# Altium schematic sheet CON_PCI_Express_X8_98PIN.SchDoc: PCI Express x8 98Pin
size A4
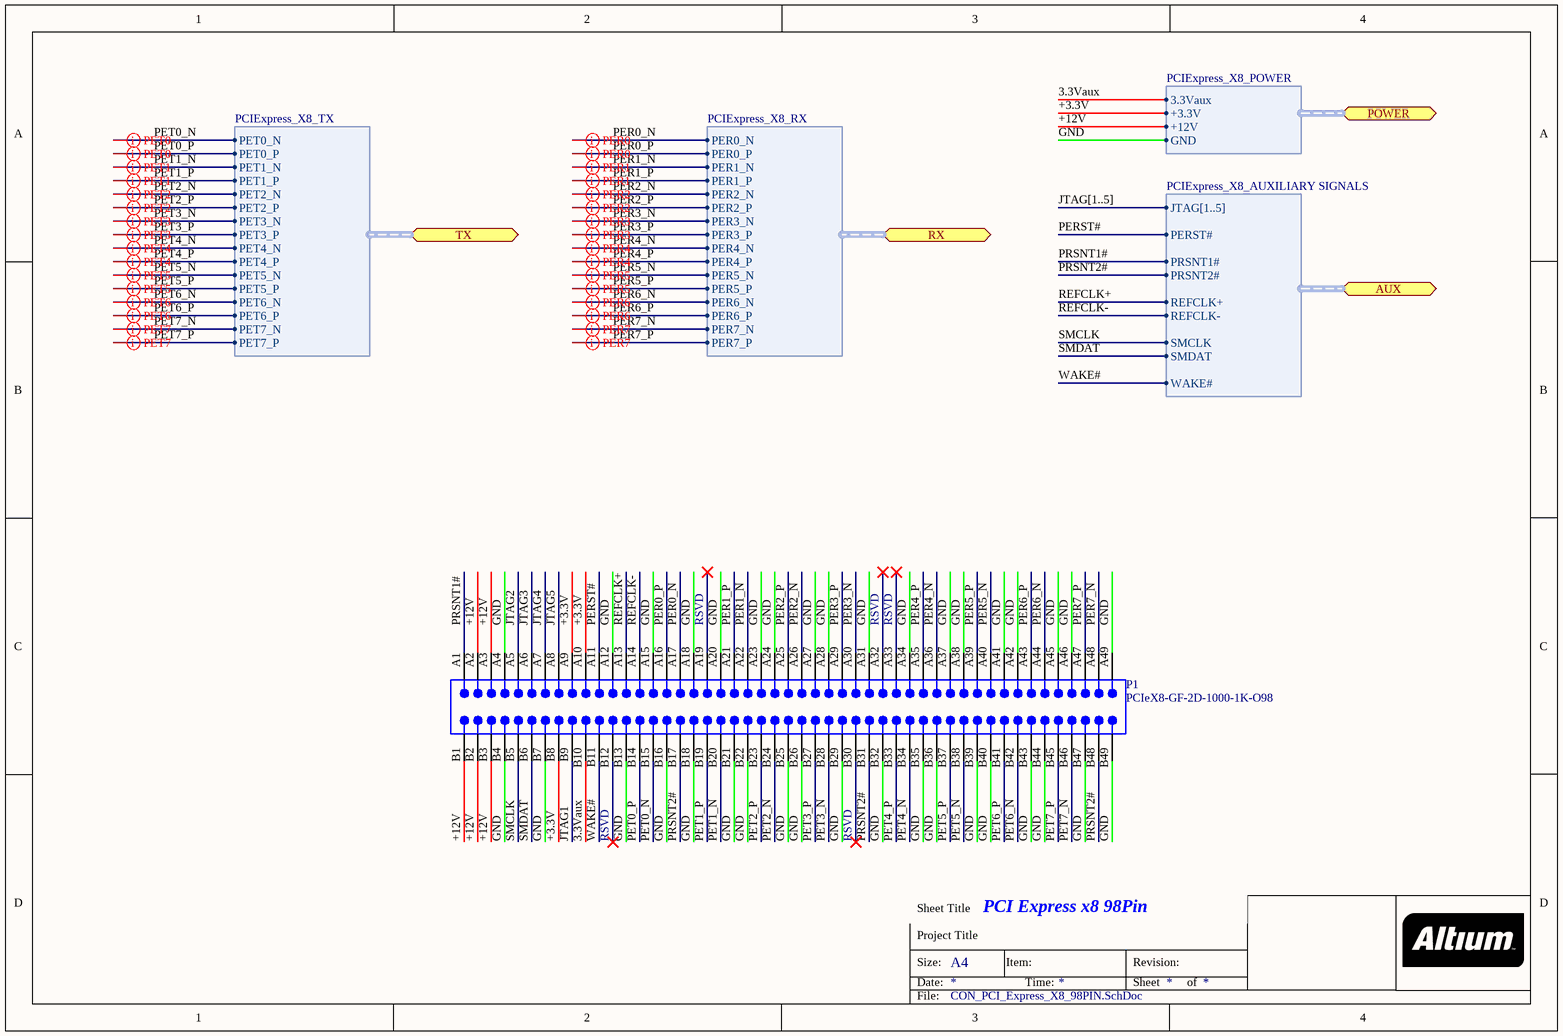
[diagram p0: CON_PCI_Express_X8_98PIN.SchDoc]

## Parts
P1  PCIeX8-GF-2D-1000-1K-O98  [PCIeX8-GF-2D-1000-1K-O98]  (no BOM)

## Ports
AUX (harness PCIExpress_X8_AUXILIARY SIGNALS), POWER (harness PCIExpress_X8_POWER), RX (harness PCIExpress_X8_RX), TX (harness PCIExpress_X8_TX)

## Harnesses
PCIExpress_X8_RX: PER0_N, PER0_P, PER1_N, PER1_P, PER2_N, PER2_P, PER3_N, PER3_P, PER4_N, PER4_P, PER5_N, PER5_P, PER6_N, PER6_P, PER7_N, PER7_P
PCIExpress_X8_TX: PET0_N, PET0_P, PET1_N, PET1_P, PET2_N, PET2_P, PET3_N, PET3_P, PET4_N, PET4_P, PET5_N, PET5_P, PET6_N, PET6_P, PET7_N, PET7_P
PCIExpress_X8_POWER: +3.3V, +12V, GND, 3.3Vaux
PCIExpress_X8_AUXILIARY SIGNALS: JTAG[1..5], PERST#, PRSNT1#, PRSNT2#, REFCLK+, REFCLK-, SMCLK, SMDAT, WAKE#

## Nets
3.3Vaux: P1.B10 ; port POWER.3.3Vaux
+3.3V: P1.A9 P1.A10 P1.B8 ; port POWER.+3.3V
+12V: P1.A2 P1.A3 P1.B1 P1.B2 P1.B3 ; port POWER.+12V
GND: P1.A4 P1.A12 P1.A15 P1.A18 P1.A20 P1.A23 P1.A24 P1.A27 P1.A28 P1.A31 P1.A34 P1.A37 P1.A38 P1.A41 P1.A42 P1.A45 P1.A46 P1.A49 P1.B4 P1.B7 P1.B13 P1.B16 P1.B18 P1.B21 P1.B22 P1.B25 P1.B26 P1.B29 P1.B32 P1.B35 P1.B36 P1.B39 P1.B40 P1.B43 P1.B44 P1.B47 P1.B49 ; port POWER.GND
JTAG1: P1.B9
JTAG2: P1.A5
JTAG3: P1.A6
JTAG4: P1.A7
JTAG5: P1.A8
PER0_N: P1.A17 ; port RX.PER0_N
PER0_P: P1.A16 ; port RX.PER0_P
PER1_N: P1.A22 ; port RX.PER1_N
PER1_P: P1.A21 ; port RX.PER1_P
PER2_N: P1.A26 ; port RX.PER2_N
PER2_P: P1.A25 ; port RX.PER2_P
PER3_N: P1.A30 ; port RX.PER3_N
PER3_P: P1.A29 ; port RX.PER3_P
PER4_N: P1.A36 ; port RX.PER4_N
PER4_P: P1.A35 ; port RX.PER4_P
PER5_N: P1.A40 ; port RX.PER5_N
PER5_P: P1.A39 ; port RX.PER5_P
PER6_N: P1.A44 ; port RX.PER6_N
PER6_P: P1.A43 ; port RX.PER6_P
PER7_N: P1.A48 ; port RX.PER7_N
PER7_P: P1.A47 ; port RX.PER7_P
PERST#: P1.A11 ; port AUX.PERST#
PET0_N: P1.B15 ; port TX.PET0_N
PET0_P: P1.B14 ; port TX.PET0_P
PET1_N: P1.B20 ; port TX.PET1_N
PET1_P: P1.B19 ; port TX.PET1_P
PET2_N: P1.B24 ; port TX.PET2_N
PET2_P: P1.B23 ; port TX.PET2_P
PET3_N: P1.B28 ; port TX.PET3_N
PET3_P: P1.B27 ; port TX.PET3_P
PET4_N: P1.B34 ; port TX.PET4_N
PET4_P: P1.B33 ; port TX.PET4_P
PET5_N: P1.B38 ; port TX.PET5_N
PET5_P: P1.B37 ; port TX.PET5_P
PET6_N: P1.B42 ; port TX.PET6_N
PET6_P: P1.B41 ; port TX.PET6_P
PET7_N: P1.B46 ; port TX.PET7_N
PET7_P: P1.B45 ; port TX.PET7_P
PRSNT1#: P1.A1 ; port AUX.PRSNT1#
PRSNT2#: P1.B17 P1.B31 P1.B48 ; port AUX.PRSNT2#
REFCLK+: P1.A13 ; port AUX.REFCLK+
REFCLK-: P1.A14 ; port AUX.REFCLK-
SMCLK: P1.B5 ; port AUX.SMCLK
SMDAT: P1.B6 ; port AUX.SMDAT
WAKE#: P1.B11 ; port AUX.WAKE#

Not connected (* = marked no-connect by the designer): P1 A19* A32* A33* B12* B30*

## Buses and harness runs
bus JTAG[1..5]

## Layout directives
differential pair: PER0_N, PER0_P, PER1_N, PER1_P, PER2_N, PER2_P, PER3_N, PER3_P, PER4_N, PER4_P, PER5_N, PER5_P, PER6_N, PER6_P, PER7_N, PER7_P, PET0_N, PET0_P, PET1_N, PET1_P, PET2_N, PET2_P, PET3_N, PET3_P, PET4_N, PET4_P, PET5_N, PET5_P, PET6_N, PET6_P, PET7_N, PET7_P

## Notes on the sheet
- RSVD
- Sheet Title
- Project Title
- Size:
- Date:
- A4
- Item:
- Time:
- Revision:
- Sheet
- of
- File:

## Library data of the parts
P1 = CMP-0001-00032-2: Golden finger, PCIeX8, Dual, Opposite, Pitch 1mm, 98-Position; Mating Connector: Molex-87715-9205; Datasheet Version: rev2.0, Apr-2007; ClassName: Edge Connector; Publisher: Altium; Package Reference: PCIeX8-GF-2D-1000-1K-O98